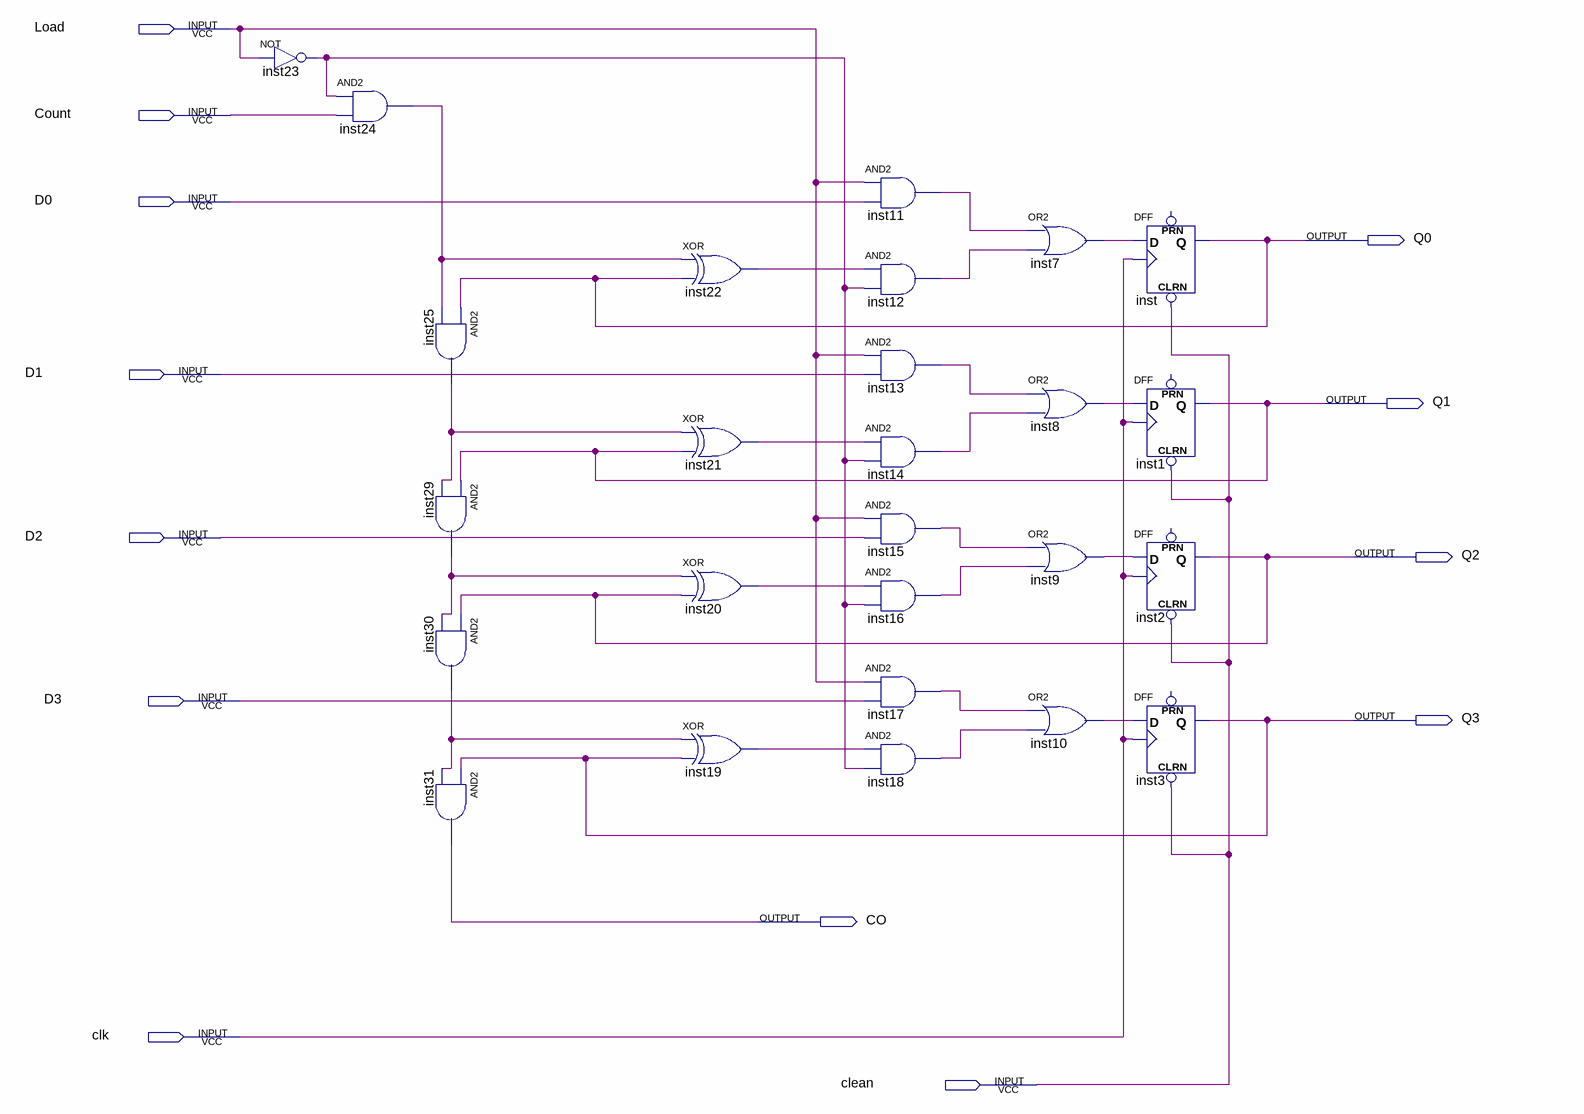
[diagram p0: schematic sheet]
// Quartus schematic lab04.bdf as structural Verilog: 26 symbols, 13 pins
module lab04 (
  input  Load,
  input  Count,
  input  D0,
  input  D1,
  input  D2,
  input  D3,
  input  clk,
  input  clean,
  output Q0,
  output Q1,
  output Q2,
  output Q3,
  output CO
);

  wire inst7_out, inst8_out, inst9_out, inst10_out, inst11_out, inst12_out, inst13_out, inst14_out,
       inst15_out, inst16_out, inst17_out, inst18_out, inst19_out, inst20_out, inst21_out, inst22_out,
       inst23_out, inst24_out, inst25_out, inst29_out, inst30_out;

  not inst23 (inst23_out, Load);
  and inst24 (inst24_out, inst23_out, Count);
  and inst25 (inst25_out, Q0, inst24_out);
  and inst29 (inst29_out, Q1, inst25_out);
  and inst30 (inst30_out, Q2, inst29_out);
  and inst31 (CO, Q3, inst30_out);
  xor inst22 (inst22_out, inst24_out, Q0);
  xor inst21 (inst21_out, inst25_out, Q1);
  xor inst20 (inst20_out, inst29_out, Q2);
  xor inst19 (inst19_out, inst30_out, Q3);
  and inst11 (inst11_out, Load, D0);
  and inst12 (inst12_out, inst22_out, inst23_out);
  and inst13 (inst13_out, Load, D1);
  and inst14 (inst14_out, inst21_out, inst23_out);
  and inst15 (inst15_out, Load, D2);
  and inst16 (inst16_out, inst20_out, inst23_out);
  and inst17 (inst17_out, Load, D3);
  and inst18 (inst18_out, inst19_out, inst23_out);
  or inst7 (inst7_out, inst11_out, inst12_out);
  or inst8 (inst8_out, inst13_out, inst14_out);
  or inst9 (inst9_out, inst15_out, inst16_out);
  or inst10 (inst10_out, inst17_out, inst18_out);
  DFF inst (.CLRN(clean), .CLK(clk), .D(inst7_out), .Q(Q0));  // open: PRN
  DFF inst1 (.CLRN(clean), .CLK(clk), .D(inst8_out), .Q(Q1));  // open: PRN
  DFF inst2 (.CLRN(clean), .CLK(clk), .D(inst9_out), .Q(Q2));  // open: PRN
  DFF inst3 (.CLRN(clean), .CLK(clk), .D(inst10_out), .Q(Q3));  // open: PRN
endmodule
